# Altium project BugBuster.PrjPcb (part 2 of 4)

## Sheet Power.SchDoc
size A3; SheetNumber: 3; SheetTotal: 5
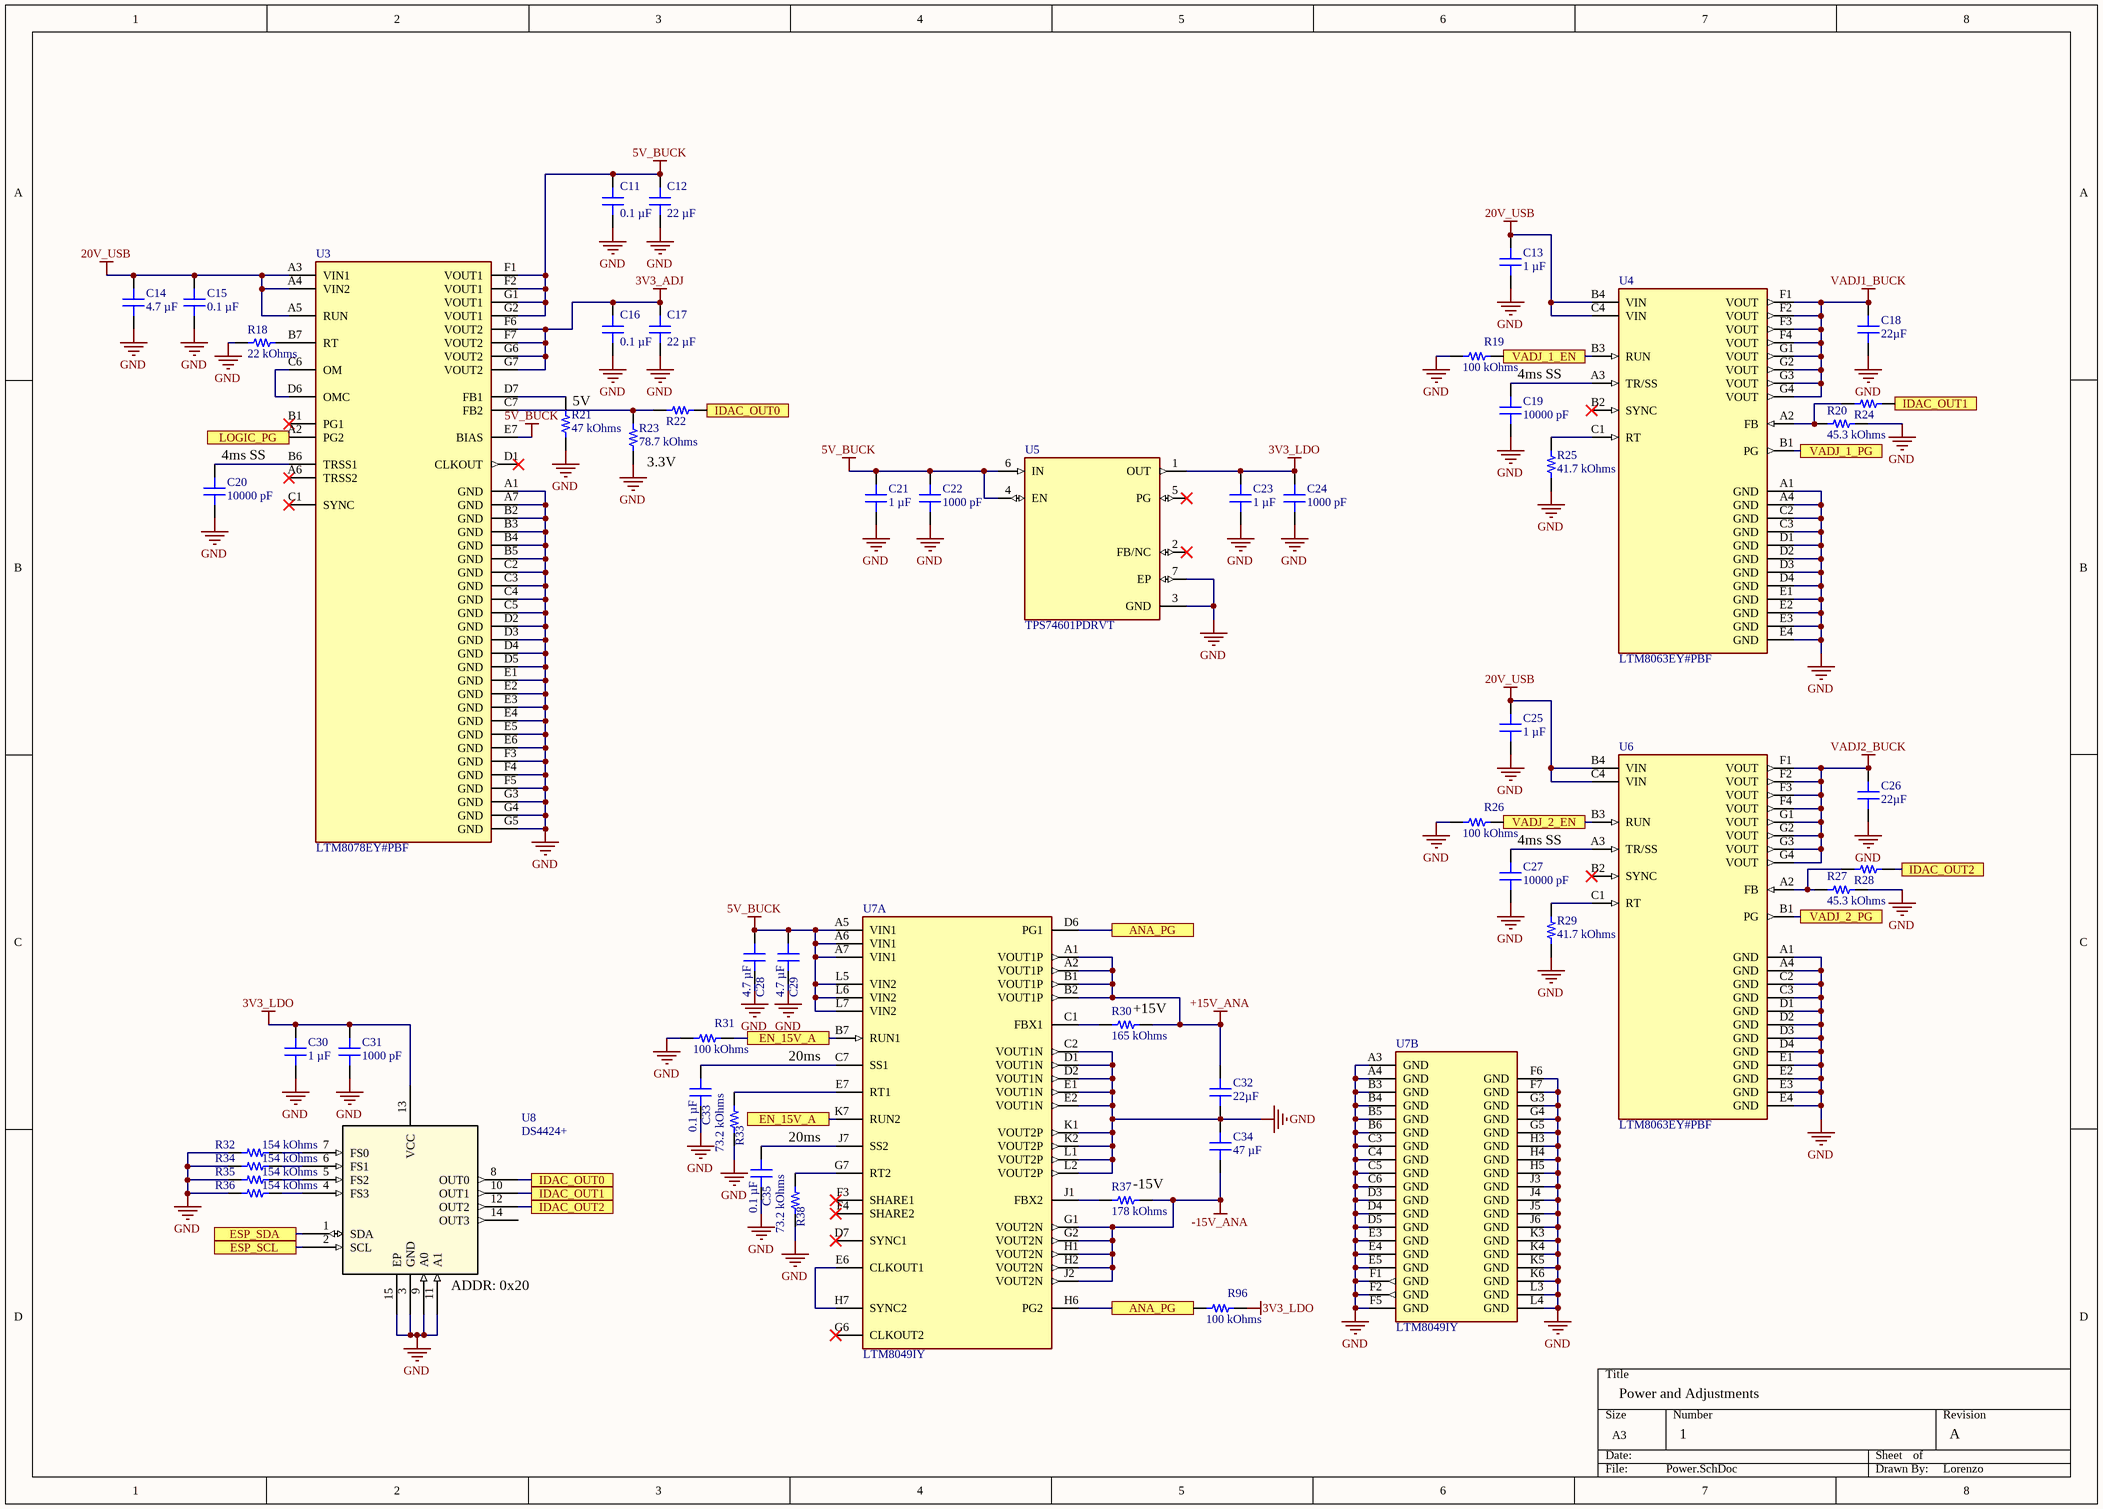
[diagram p2: Power.SchDoc]

### Parts
C11  0.1 µF  [CAP 0603_1608]
C12  22 µF  [CAP 0603_1608]
C13  1 µF  [CAP 0603_1608]
C14  4.7 µF  [CAP 0603_1608]
C15  0.1 µF  [CAP 0603_1608]
C16  0.1 µF  [CAP 0603_1608]
C17  22 µF  [CAP 0603_1608]
C18  22µF  [CAP 1210_3225 - 2.8MM]
C19  10000 pF  [CAP 0603_1608]
C20  10000 pF  [CAP 0603_1608]
C21  1 µF  [CAP 0603_1608]
C22  1000 pF  [CAP 0603_1608]
C23  1 µF  [CAP 0603_1608]
C24  1000 pF  [CAP 0603_1608]
C25  1 µF  [CAP 0603_1608]
C26  22µF  [CAP 1210_3225 - 2.8MM]
C27  10000 pF  [CAP 0603_1608]
C28  4.7 µF  [CAP 0603_1608]
C29  4.7 µF  [CAP 0603_1608]
C30  1 µF  [CAP 0603_1608]
C31  1000 pF  [CAP 0603_1608]
C32  22µF  [CAP 1210_3225 - 2.8MM]
C33  0.1 µF  [CAP 0603_1608]
C34  47 µF  [CAP 1210_3225 - 1MM]
C35  0.1 µF  [CAP 0603_1608]
R18  22 kOhms  [RES 0603_1608]
R19  100 kOhms  [RES 0603_1608]
R20  45.3 kOhms  [RES 0603_1608]
R21  47 kOhms  [RES 0603_1608]
R22  (no value)  [RES 0603_1608]
R23  78.7 kOhms  [RES 0603_1608]
R24  (no value)  [RES 0603_1608]
R25  41.7 kOhms  [RES 0603_1608]
R26  100 kOhms  [RES 0603_1608]
R27  45.3 kOhms  [RES 0603_1608]
R28  (no value)  [RES 0603_1608]
R29  41.7 kOhms  [RES 0603_1608]
R30  165 kOhms  [RES 0603_1608]
R31  100 kOhms  [RES 0603_1608]
R32  154 kOhms  [RES 0603_1608]
R33  73.2 kOhms  [RES 0603_1608]
R34  154 kOhms  [RES 0603_1608]
R35  154 kOhms  [RES 0603_1608]
R36  154 kOhms  [RES 0603_1608]
R37  178 kOhms  [RES 0603_1608]
R38  73.2 kOhms  [RES 0603_1608]
R96  100 kOhms  [RES 0603_1608]
U3  LTM8078EY#PBF  [FP-BGA-49-05-08-1518-IPC_C]
U4  LTM8063EY#PBF  [FP-BGA-28-05-08-1517-MFG]
U5  TPS74601PDRVT  [SON65P200X200X80-7N]
U6  LTM8063EY#PBF  [FP-BGA-28-05-08-1517-MFG]
U7  LTM8049IY  [FP-BGA-77-05-08-1964-MFG]  (parts A,B of 2)
U8  DS4424+  [21-0137_T1433+2_MXM]

### Ports
ANA_PG, EN_15V_A, ESP_SCL, ESP_SDA, IDAC_OUT0, IDAC_OUT1, IDAC_OUT2, LOGIC_PG, VADJ_1_EN, VADJ_1_PG, VADJ_2_EN, VADJ_2_PG

### Nets
3V3_ADJ: C16.2 C17.2 U3.F6(VOUT2) U3.F7(VOUT2) U3.G6(VOUT2) U3.G7(VOUT2)
3V3_LDO: C23.2 C24.2 C30.2 C31.2 R96.2 U5.1(OUT) U8.13(VCC)
5V_BUCK: C11.2 C12.2 C21.2 C22.2 C28.2 C29.2 U3.E7(BIAS) U3.F1(VOUT1) U3.F2(VOUT1) U3.G1(VOUT1) U3.G2(VOUT1) U5.4(EN) U5.6(IN) U7.A5(VIN1) U7.A6(VIN1) U7.A7(VIN1) U7.L5(VIN2) U7.L6(VIN2) U7.L7(VIN2)
20V_USB: C13.2 C14.2 C15.2 C25.2 U3.A3(VIN1) U3.A4(VIN2) U3.A5(RUN) U4.B4(VIN) U4.C4(VIN) U6.B4(VIN) U6.C4(VIN)
+15V_ANA: C32.2 R30.2 U7.A1(VOUT1P) U7.A2(VOUT1P) U7.B1(VOUT1P) U7.B2(VOUT1P)
-15V_ANA: C34.1 R37.2 U7.G1(VOUT2N) U7.G2(VOUT2N) U7.H1(VOUT2N) U7.H2(VOUT2N) U7.J2(VOUT2N)
GND: C11.1 C12.1 C13.1 C14.1 C15.1 C16.1 C17.1 C18.1 C19.1 C20.1 C21.1 C22.1 C23.1 C24.1 C25.1 C26.1 C27.1 C28.1 C29.1 C30.1 C31.1 C32.1 C33.1 C34.2 C35.1 R18.1 R19.1 R20.1 R21.1 R23.1 R25.1 R26.1 R27.1 R29.1 R31.1 R32.1 R33.1 R34.1 R35.1 R36.1 R38.1 U3.A1(GND) U3.A7(GND) U3.B2(GND) U3.B3(GND) U3.B4(GND) U3.B5(GND) U3.C2(GND) U3.C3(GND) U3.C4(GND) U3.C5(GND) U3.D2(GND) U3.D3(GND) U3.D4(GND) U3.D5(GND) U3.E1(GND) U3.E2(GND) U3.E3(GND) U3.E4(GND) U3.E5(GND) U3.E6(GND) U3.F3(GND) U3.F4(GND) U3.F5(GND) U3.G3(GND) U3.G4(GND) U3.G5(GND) U4.A1(GND) U4.A4(GND) U4.C2(GND) U4.C3(GND) U4.D1(GND) U4.D2(GND) U4.D3(GND) U4.D4(GND) U4.E1(GND) U4.E2(GND) U4.E3(GND) U4.E4(GND) U5.3(GND) U5.7(EP) U6.A1(GND) U6.A4(GND) U6.C2(GND) U6.C3(GND) U6.D1(GND) U6.D2(GND) U6.D3(GND) U6.D4(GND) U6.E1(GND) U6.E2(GND) U6.E3(GND) U6.E4(GND) U7.A3(GND) U7.A4(GND) U7.B3(GND) U7.B4(GND) U7.B5(GND) U7.B6(GND) U7.C2(VOUT1N) U7.C3(GND) U7.C4(GND) U7.C5(GND) U7.C6(GND) U7.D1(VOUT1N) U7.D2(VOUT1N) U7.D3(GND) U7.D4(GND) U7.D5(GND) U7.E1(VOUT1N) U7.E2(VOUT1N) U7.E3(GND) U7.E4(GND) U7.E5(GND) U7.F1(GND) U7.F2(GND) U7.F5(GND) U7.F6(GND) U7.F7(GND) U7.G3(GND) U7.G4(GND) U7.G5(GND) U7.H3(GND) U7.H4(GND) U7.H5(GND) U7.J3(GND) U7.J4(GND) U7.J5(GND) U7.J6(GND) U7.K1(VOUT2P) U7.K2(VOUT2P) U7.K3(GND) U7.K4(GND) U7.K5(GND) U7.K6(GND) U7.L1(VOUT2P) U7.L2(VOUT2P) U7.L3(GND) U7.L4(GND) U8.3(GND) U8.9(A0) U8.11(A1) U8.15(EP)
VADJ1_BUCK: C18.2 U4.F1(VOUT) U4.F2(VOUT) U4.F3(VOUT) U4.F4(VOUT) U4.G1(VOUT) U4.G2(VOUT) U4.G3(VOUT) U4.G4(VOUT)
VADJ2_BUCK: C26.2 U6.F1(VOUT) U6.F2(VOUT) U6.F3(VOUT) U6.F4(VOUT) U6.G1(VOUT) U6.G2(VOUT) U6.G3(VOUT) U6.G4(VOUT)
NetC19_2: C19.2 U4.A3(TR/SS)
NetC20_2: C20.2 U3.B6(TRSS1)
NetC27_2: C27.2 U6.A3(TR/SS)
NetC33_2: C33.2 U7.C7(SS1)
NetC35_2: C35.2 U7.J7(SS2)
NetR1_1: U8.1(SDA) ; port ESP_SDA
NetR2_1: U8.2(SCL) ; port ESP_SCL
NetR18_2: R18.2 U3.B7(RT)
NetR19_2: R19.2 U4.B3(RUN) ; port VADJ_1_EN
NetR20_2: R20.2 R24.1 U4.A2(FB)
NetR21_2: R21.2 U3.D7(FB1)
NetR22_1: R22.1 R23.2 U3.C7(FB2)
NetR22_2: R22.2 U8.8(OUT0) ; port IDAC_OUT0
NetR24_2: R24.2 U8.10(OUT1) ; port IDAC_OUT1
NetR25_2: R25.2 U4.C1(RT)
NetR26_2: R26.2 U6.B3(RUN) ; port VADJ_2_EN
NetR27_2: R27.2 R28.1 U6.A2(FB)
NetR28_2: R28.2 U8.12(OUT2) ; port IDAC_OUT2
NetR29_2: R29.2 U6.C1(RT)
NetR30_1: R30.1 U7.C1(FBX1)
NetR31_2: R31.2 U7.B7(RUN1) U7.K7(RUN2) ; port EN_15V_A
NetR32_2: R32.2 U8.7(FS0)
NetR33_2: R33.2 U7.E7(RT1)
NetR34_2: R34.2 U8.6(FS1)
NetR35_2: R35.2 U8.5(FS2)
NetR36_2: R36.2 U8.4(FS3)
NetR37_1: R37.1 U7.J1(FBX2)
NetR38_2: R38.2 U7.G7(RT2)
NetR96_1: R96.1 U7.D6(PG1) U7.H6(PG2) ; port ANA_PG
NetU3_A2: U3.A2(PG2) ; port LOGIC_PG
NetU3_C6: U3.C6(OM) U3.D6(OMC)
NetU4_B1: U4.B1(PG) ; port VADJ_1_PG
NetU6_B1: U6.B1(PG) ; port VADJ_2_PG
NetU7_E6: U7.E6(CLKOUT1) U7.H7(SYNC2)

Not connected (* = marked no-connect by the designer): U3 A6(TRSS2)* B1(PG1)* C1(SYNC)* D1(CLKOUT)*; U4 B2(SYNC)*; U5 2(FB/NC)* 5(PG)*; U6 B2(SYNC)*; U7 D7(SYNC1)* F3(SHARE1)* F4(SHARE2)* G6(CLKOUT2)*; U8 14(OUT3)

### Notes on the sheet
- (near C19) 4ms SS
- (near R21) 5V
- (near C20) 4ms SS
- (near R23) 3.3V
- (near C27) 4ms SS
- (near R30) +15V
- 20ms
- (near R37) -15V
- (near U8) ADDR: 0x20
- Power and Adjustments
- 1
- A
- Lorenzo

### Library data of the parts
C11 C15 C16 C33 C35 = CGA3E2X7R1H104M080AE: CAP CER 0.1UF 50V X7R 0603; manufacturer: TDK Corporation; Tolerance: ±20%; Part Number: CGA3E2X7R1H104M080AE; Value: 0.1 µF; Applications: Automotive, Boardflex Sensitive; Capacitance: 0.1 µF; componentlink1description: Datasheet; componentlink1url: https://product.tdk.com/info/en/catalog/datasheets/mlcc_automotive_soft_en.pdf?ref_disty=digikey; componentlink2description: DigiKey Link; componentlink2url: https://www.digikey.com/en/products/detail/tdk-corporation/CGA3E2X7R1H104M080AE/4490595; Device Package: 0603 (1608 Metric); Features: Soft Termination; lastupdated: 09/02/2024 20:10:15; Lifecycle Status: Active; Minimum Order: 1; Mounting Type: Surface Mount, MLCC; Operating Temperature: -55°C ~ 125°C; Package / Case: 0603 (1608 Metric); packaging: TapeAndReel; partid: 13634; Part Status: Active; price: 0.03; Ratings: AEC-Q200; series: CGA; Size / Dimension: 0.063" L x 0.031" W (1.60mm x 0.80mm); Supplier 1: DigiKey; Supplier Part Number 1: 445-15958-1-ND; Temperature Coefficient: X7R; Thickness (Max): 0.037" (0.95mm); Voltage - Rated: 50V
C12 C17 = CC0603MRX6S5BB226: CAP CER 22UF 6.3V X6S 0603; manufacturer: Yageo; Tolerance: ±20%; Part Number: CC0603MRX6S5BB226; Value: 22 µF; Applications: General Purpose; Capacitance: 22 µF; componentlink1description: Datasheet; componentlink1url: https://www.yageo.com/upload/media/product/productsearch/datasheet/mlcc/UPY-GPHC_X6S_4V-to-50V_5.pdf; componentlink2description: DigiKey Link; componentlink2url: https://www.digikey.com/en/products/detail/yageo/CC0603MRX6S5BB226/12698890; Device Package: 0603 (1608 Metric); lastupdated: 09/02/2024 20:09:49; Lifecycle Status: Active; Minimum Order: 1; Mounting Type: Surface Mount, MLCC; Operating Temperature: -55°C ~ 105°C; Package / Case: 0603 (1608 Metric); packaging: TapeAndReel; partid: 45941; Part Status: Active; price: 0.03; series: CC; Size / Dimension: 0.063" L x 0.031" W (1.60mm x 0.80mm); Supplier 1: DigiKey; Supplier Part Number 1: 13-CC0603MRX6S5BB226CT-ND; Temperature Coefficient: X6S; Thickness (Max): 0.039" (1.00mm); Voltage - Rated: 6.3V
C13 C21 C23 C25 C30 = C1608X5R1H105K080AB: CAP CER 1UF 50V X5R 0603; manufacturer: TDK Corporation; Tolerance: ±10%; Part Number: C1608X5R1H105K080AB; Value: 1 µF; Applications: General Purpose; Capacitance: 1 µF; componentlink1description: Datasheet; componentlink1url: https://product.tdk.com/info/en/catalog/datasheets/mlcc_commercial_general_en.pdf?ref_disty=digikey; componentlink2description: DigiKey Link; componentlink2url: https://www.digikey.com/en/products/detail/tdk-corporation/C1608X5R1H105K080AB/2732903; Device Package: 0603 (1608 Metric); Features: Low ESL; lastupdated: 09/02/2024 20:10:02; Lifecycle Status: Active; Minimum Order: 1; Mounting Type: Surface Mount, MLCC; Operating Temperature: -55°C ~ 85°C; Package / Case: 0603 (1608 Metric); packaging: TapeAndReel; partid: 36337; Part Status: Active; price: 0.02; series: C; Size / Dimension: 0.063" L x 0.031" W (1.60mm x 0.80mm); Supplier 1: DigiKey; Supplier Part Number 1: 445-7468-1-ND; Temperature Coefficient: X5R; Thickness (Max): 0.035" (0.90mm); Voltage - Rated: 50V
C14 C28 C29 = GRM188R61E475ME11J: CAP CER 4.7UF 25V X5R 0603; manufacturer: Murata Electronics; Tolerance: ±20%; Part Number: GRM188R61E475ME11J; Value: 4.7 µF; Applications: General Purpose; Capacitance: 4.7 µF; componentlink2description: DigiKey Link; componentlink2url: https://www.digikey.com/en/products/detail/murata-electronics/GRM188R61E475ME11J/10703204; Device Package: 0603 (1608 Metric); lastupdated: 09/02/2024 20:09:44; Lifecycle Status: Active; Minimum Order: 1; Mounting Type: Surface Mount, MLCC; Operating Temperature: -55°C ~ 85°C; Package / Case: 0603 (1608 Metric); packaging: TapeAndReel; partid: 47573; Part Status: Active; price: 0.03; series: GRM; Size / Dimension: 0.063" L x 0.032" W (1.60mm x 0.80mm); Supplier 1: DigiKey; Supplier Part Number 1: 490-GRM188R61E475ME11JCT-ND; Temperature Coefficient: X5R; Thickness (Max): 0.037" (0.95mm); Voltage - Rated: 25V
C18 C26 C32 = 12103C226KAT2A: CAP CER 22UF 25V X7R 1210; manufacturer: AVX Corporation; Tolerance: ±10%; Part Number: 12103C226KAT2A; Value: 22µF; Applications: General Purpose; Capacitance: 22µF; componentlink1description: Datasheet; componentlink1url: http://datasheets.avx.com/X7RDielectric.pdf; componentlink2description: DigiKey Link; componentlink2url: http://digikey.com/product-detail/en/avx-corporation/12103C226KAT2A/478-9964-1-ND/6149088; Device Package: 1210 (3225 Metric); lastupdated: 02/09/2020 01:10:48; Lifecycle Status: Active; Minimum Order: 1; Mounting Type: Surface Mount, MLCC; Operating Temperature: -55°C ~ 125°C; Package / Case: 1210 (3225 Metric); packaging: TapeAndReel; partid: 24236; Part Status: Active; price: 0.91; series: -; Size / Dimension: 0.130" L x 0.098" W (3.30mm x 2.50mm); Supplier 1: DigiKey; Supplier Part Number 1: 478-9964-1-ND; Temperature Coefficient: X7R; Thickness (Max): 0.110" (2.79mm); Voltage - Rated: 25V
C19 C20 C27 = C0603X103K5RAC7867: CAP CER 10000PF 50V X7R 0603; manufacturer: KEMET; Tolerance: ±10%; Part Number: C0603X103K5RAC7867; Value: 10000 pF; Applications: Boardflex Sensitive; Capacitance: 10000 pF; componentlink1description: Datasheet; componentlink1url: https://api.kemet.com/component-edge/download/datasheet/C0603X103K5RACTU.pdf; componentlink2description: DigiKey Link; componentlink2url: https://www.digikey.com/en/products/detail/kemet/C0603X103K5RAC7867/1842288; Device Package: 0603 (1608 Metric); Features: Soft Termination; lastupdated: 09/02/2024 20:09:59; Lifecycle Status: Active; Minimum Order: 1; Mounting Type: Surface Mount, MLCC; Operating Temperature: -55°C ~ 125°C; Package / Case: 0603 (1608 Metric); packaging: TapeAndReel; partid: 35676; Part Status: Active; price: 0.06; series: SMD Comm X7R Flex; Size / Dimension: 0.063" L x 0.031" W (1.60mm x 0.80mm); Supplier 1: DigiKey; Supplier Part Number 1: 399-C0603X103K5RAC7867CT-ND; Temperature Coefficient: X7R; Thickness (Max): 0.034" (0.87mm); Voltage - Rated: 50V
C22 C24 C31 = CC0603GRNPO8BN102: CAP CER 1000PF 25V C0G/NPO 0603; manufacturer: Yageo; Temperature Coefficient: C0G, NP0; Tolerance: ±2%; Part Number: CC0603GRNPO8BN102; Value: 1000 pF; Applications: General Purpose; Capacitance: 1000 pF; componentlink1description: Datasheet; componentlink1url: https://www.yageo.com/upload/media/product/productsearch/datasheet/mlcc/UPY-GP_NP0_16V-to-50V_17.pdf; componentlink2description: DigiKey Link; componentlink2url: https://www.digikey.com/en/products/detail/yageo/CC0603GRNPO8BN102/5883535; Device Package: 0603 (1608 Metric); lastupdated: 09/02/2024 20:10:07; Lifecycle Status: Active; Minimum Order: 1; Mounting Type: Surface Mount, MLCC; Operating Temperature: -55°C ~ 125°C; Package / Case: 0603 (1608 Metric); packaging: TapeAndReel; partid: 17388; Part Status: Active; price: 0.02; series: CC; Size / Dimension: 0.063" L x 0.031" W (1.60mm x 0.80mm); Supplier 1: DigiKey; Supplier Part Number 1: 311-3914-1-ND; Thickness (Max): 0.035" (0.90mm); Voltage - Rated: 25V
C34 = KGM32LR51E476MU: CAP CER 47UF 25V X5R 1210; manufacturer: KYOCERA AVX; Tolerance: ±20%; Part Number: KGM32LR51E476MU; Value: 47 µF; Applications: General Purpose; Capacitance: 47 µF; componentlink2description: DigiKey Link; componentlink2url: https://www.digikey.com/en/products/detail/kyocera-avx/KGM32LR51E476MU/11231511; Device Package: 1210 (3225 Metric); lastupdated: 04/06/2024 19:20:46; Lifecycle Status: Active; Minimum Order: 1; Mounting Type: Surface Mount, MLCC; Operating Temperature: -55°C ~ 85°C; Package / Case: 1210 (3225 Metric); packaging: TapeAndReel; partid: 51635; Part Status: Active; price: 1.07; series: KGM - X5R; Size / Dimension: 0.126" L x 0.098" W (3.20mm x 2.50mm); Supplier 1: DigiKey; Supplier Part Number 1: 478-KGM32LR51E476MUCT-ND; Temperature Coefficient: X5R; Thickness (Max): 0.110" (2.80mm); Voltage - Rated: 25V
R18 = KTR03EZPF2202: RES SMD 22K OHM 1% 1/10W 0603; Manufacturer: Rohm Semiconductor; Power (Watts): 0.1W, 1/10W; Temperature Coefficient: ±100ppm/°C; Part Number: KTR03EZPF2202; Value: 22 kOhms; ComponentLink1Description: Datasheet; ComponentLink1URL: https://www.rohm.com/datasheet/KTR03EZPF/ktr-e; ComponentLink2Description: DigiKey Link; ComponentLink2URL: https://www.digikey.com/en/products/detail/rohm-semiconductor/KTR03EZPF2202/4051603; Composition: Thick Film; Device Package: 0603 (1608 Metric); Features: Automotive AEC-Q200, High Voltage; Height - Seated (Max): 0.022" (0.55mm); LastUpdated: 09/02/2024 20:43:35; Lifecycle Status: Active; Minimum Order: 1; Number of Terminations: 2; Operating Temperature: -55°C ~ 155°C; Package / Case: 0603 (1608 Metric); Packaging: TapeAndReel; PartId: 5323; Part Status: Active; Price: 0.02; Ratings: AEC-Q200; Resistance: 22 kOhms; Series: KTR; Size / Dimension: 0.063" L x 0.031" W (1.60mm x 0.80mm); Supplier 1: DigiKey; Supplier Part Number 1: RHM22KAYCT-ND; Supplier Device Package: 0603; Tolerance: ±1%
R19 R26 R31 R96 = SG73P1JTTD1003F: RES 100K OHM 1% 1/3W 0603; Manufacturer: KOA Speer Electronics, Inc.; Power (Watts): 0.333W, 1/3W; Temperature Coefficient: ±100ppm/°C; Part Number: SG73P1JTTD1003F; Value: 100 kOhms; ComponentLink1Description: Datasheet; ComponentLink1URL: https://www.koaspeer.com/pdfs/SG73P.pdf; ComponentLink2Description: DigiKey Link; ComponentLink2URL: https://www.digikey.com/en/products/detail/koa-speer-electronics-inc/SG73P1JTTD1003F/10188341; Composition: Thick Film; Device Package: 0603 (1608 Metric); Features: Automotive AEC-Q200, Pulse Withstanding; Height - Seated (Max): 0.022" (0.55mm); LastUpdated: 09/02/2024 20:40:28; Lifecycle Status: Active; Minimum Order: 1; Number of Terminations: 2; Operating Temperature: -55°C ~ 155°C; Package / Case: 0603 (1608 Metric); Packaging: TapeAndReel; PartId: 83707; Price: 0.01; Ratings: AEC-Q200; Resistance: 100 kOhms; Series: SG73P; Size / Dimension: 0.063" L x 0.031" W (1.60mm x 0.80mm); Supplier 1: DigiKey; Supplier Part Number 1: 2019-SG73P1JTTD1003FCT-ND; Supplier Device Package: 0603; Tolerance: ±1%
R20 R27 = AC0603FR-0745K3L: RES SMD 45.3K OHM 1% 1/10W 0603; Manufacturer: Yageo; Power (Watts): 0.1W, 1/10W; Temperature Coefficient: ±100ppm/°C; Part Number: AC0603FR-0745K3L; Value: 45.3 kOhms; ComponentLink1Description: Datasheet; ComponentLink1URL: https://www.yageo.com/upload/media/product/productsearch/datasheet/rchip/PYu-AC_51_RoHS_L_8.pdf; ComponentLink2Description: DigiKey Link; ComponentLink2URL: https://www.digikey.com/en/products/detail/yageo/AC0603FR-0745K3L/5896132; Composition: Thick Film; Device Package: 0603 (1608 Metric); Features: Automotive AEC-Q200, Moisture Resistant; Height - Seated (Max): 0.022" (0.55mm); LastUpdated: 09/02/2024 20:41:10; Lifecycle Status: Active; Minimum Order: 1; Number of Terminations: 2; Operating Temperature: -55°C ~ 155°C; Package / Case: 0603 (1608 Metric); Packaging: CutTape; PartId: 67933; Part Status: Active; Price: 0.01; Ratings: AEC-Q200; Resistance: 45.3 kOhms; Series: AC; Size / Dimension: 0.063" L x 0.031" W (1.60mm x 0.80mm); Supplier 1: DigiKey; Supplier Part Number 1: 13-AC0603FR-0745K3LCT-ND; Supplier Device Package: 0603; Tolerance: ±1%
R21 = RCA060347K0FKEA: RES SMD 47K OHM 1% 1/10W 0603; Manufacturer: Vishay Dale; Power (Watts): 0.1W, 1/10W; Temperature Coefficient: ±100ppm/°C; Part Number: RCA060347K0FKEA; Value: 47 kOhms; ComponentLink1Description: Datasheet; ComponentLink1URL: http://www.vishay.com/docs/20037/rcae3.pdf; ComponentLink2Description: DigiKey Link; ComponentLink2URL: https://www.digikey.com/en/products/detail/vishay-dale/RCA060347K0FKEA/4946776; Composition: Thick Film; Device Package: 0603 (1608 Metric); Features: Anti-Sulfur, Automotive AEC-Q200; Height - Seated (Max): 0.020" (0.50mm); LastUpdated: 09/02/2024 20:43:04; Lifecycle Status: Active; Minimum Order: 1; Number of Terminations: 2; Operating Temperature: -55°C ~ 155°C; Package / Case: 0603 (1608 Metric); Packaging: TapeAndReel; PartId: 12976; Part Status: Active; Price: 0.01; Ratings: AEC-Q200; Resistance: 47 kOhms; Series: RCA; Size / Dimension: 0.061" L x 0.033" W (1.55mm x 0.85mm); Supplier 1: DigiKey; Supplier Part Number 1: 541-2207-1-ND; Supplier Device Package: 0603; Tolerance: ±1%
R22 R24 R28 = MCT0603MZ0000ZP500: RES 0 OHM JUMPER 1/8W 0603; Manufacturer: Vishay Beyschlag; Power (Watts): 0.125W, 1/8W; Part Number: MCT0603MZ0000ZP500; ComponentLink1Description: Datasheet; ComponentLink1URL: http://www.vishay.com/docs/28760/mcat_pro.pdf; ComponentLink2Description: DigiKey Link; ComponentLink2URL: http://digikey.com/product-detail/en/vishay-beyschlag/MCT0603MZ0000ZP500/749-1745-1-ND/7348053; Composition: Thin Film; Device Package: 0603 (1608 Metric); Features: Anti-Sulfur, Automotive AEC-Q200; Height - Seated (Max): 0.022" (0.55mm); LastUpdated: 14/02/2022 15:05:22; Lifecycle Status: Active; Minimum Order: 1; Number of Terminations: 2; Operating Temperature: -55°C ~ 155°C; Package / Case: 0603 (1608 Metric); Packaging: TapeAndReel; PartId: 10258; Part Status: Active; Price: 0.04; Ratings: AEC-Q200; Series: MCT AT - Professional; Size / Dimension: 0.061" L x 0.033" W (1.55mm x 0.85mm); Supplier 1: DigiKey; Supplier Part Number 1: 749-1745-1-ND; Supplier Device Package: 0603; Tolerance: Jumper
R23 = CPF0603F78K7C1: RES SMD 78.7K OHM 1% 1/16W 0603; Manufacturer: TE Connectivity Passive Product; Power (Watts): 0.063W, 1/16W; Temperature Coefficient: ±50ppm/°C; Part Number: CPF0603F78K7C1; Value: 78.7 kOhms; ComponentLink1Description: Datasheet; ComponentLink1URL: https://www.te.com/commerce/DocumentDelivery/DDEController?Action=srchrtrv&DocNm=1773200&DocType=DS&DocLang=English; ComponentLink2Description: DigiKey Link; ComponentLink2URL: https://www.digikey.com/en/products/detail/te-connectivity-passive-product/CPF0603F78K7C1/2384668; Composition: Thin Film; Device Package: 0603 (1608 Metric); Height - Seated (Max): 0.022" (0.55mm); LastUpdated: 09/02/2024 20:43:28; Lifecycle Status: Active; Minimum Order: 1; Number of Terminations: 2; Operating Temperature: -55°C ~ 155°C; Package / Case: 0603 (1608 Metric); Packaging: TapeAndReel; PartId: 7055; Part Status: Active; Price: 0.02; Resistance: 78.7 kOhms; Series: CPF, Neohm; Size / Dimension: 0.061" L x 0.031" W (1.55mm x 0.80mm); Supplier 1: DigiKey; Supplier Part Number 1: A102318CT-ND; Supplier Device Package: 0603; Tolerance: ±1%
R25 R29 = RN73R1JTTD4172F10: RES 41.7K OHM 1% 1/10W 0603; Manufacturer: KOA Speer Electronics, Inc.; Power (Watts): 0.1W, 1/10W; Temperature Coefficient: ±10ppm/°C; Part Number: RN73R1JTTD4172F10; Value: 41.7 kOhms; ComponentLink1Description: Datasheet; ComponentLink1URL: https://media.digikey.com/pdf/Data%20Sheets/KOA%20Speer/RN73R_Type_DS.pdf; ComponentLink2Description: DigiKey Link; ComponentLink2URL: https://www.digikey.com/en/products/detail/koa-speer-electronics-inc/RN73R1JTTD4172F10/10017113; Composition: Thin Film; Device Package: 0603 (1608 Metric); Features: Automotive AEC-Q200, Moisture Resistant; Height - Seated (Max): 0.022" (0.55mm); LastUpdated: 09/02/2024 20:41:25; Lifecycle Status: Active; Minimum Order: 1; Number of Terminations: 2; Operating Temperature: -55°C ~ 155°C; Package / Case: 0603 (1608 Metric); Packaging: TapeAndReel; PartId: 62816; Part Status: Active; Price: 0.08; Ratings: AEC-Q200; Resistance: 41.7 kOhms; Series: RN73R; Size / Dimension: 0.063" L x 0.031" W (1.60mm x 0.80mm); Supplier 1: DigiKey; Supplier Part Number 1: 2019-RN73R1JTTD4172F10CT-ND; Supplier Device Package: 0603; Tolerance: ±1%
R30 = RC0603FR-07165KL: RES 165K OHM 1% 1/10W 0603; Manufacturer: Yageo; Power (Watts): 0.1W, 1/10W; Temperature Coefficient: ±100ppm/°C; Part Number: RC0603FR-07165KL; Value: 165 kOhms; ComponentLink1Description: Datasheet; ComponentLink1URL: https://www.yageo.com/upload/media/product/productsearch/datasheet/rchip/PYu-RC_Group_51_RoHS_L_10.pdf; ComponentLink2Description: DigiKey Link; ComponentLink2URL: https://www.digikey.com/en/products/detail/yageo/RC0603FR-07165KL/726977; Composition: Thick Film; Device Package: 0603 (1608 Metric); Features: Moisture Resistant; Height - Seated (Max): 0.022" (0.55mm); LastUpdated: 09/02/2024 20:43:06; Lifecycle Status: Active; Minimum Order: 1; Number of Terminations: 2; Operating Temperature: -55°C ~ 155°C; Package / Case: 0603 (1608 Metric); Packaging: CutTape; PartId: 12456; Part Status: Active; Price: 0.01; Resistance: 165 kOhms; Series: RC_L; Size / Dimension: 0.063" L x 0.031" W (1.60mm x 0.80mm); Supplier 1: DigiKey; Supplier Part Number 1: 311-165KHRCT-ND; Supplier Device Package: 0603; Tolerance: ±1%
R32 R34-R36 = AC0603FR-07154KL: RES SMD 154K OHM 1% 1/10W 0603; Manufacturer: Yageo; Power (Watts): 0.1W, 1/10W; Temperature Coefficient: ±100ppm/°C; Part Number: AC0603FR-07154KL; Value: 154 kOhms; ComponentLink1Description: Datasheet; ComponentLink1URL: https://media.digikey.com/pdf/Data%20Sheets/Yageo%20PDFs/AC%20Series,%20Automotive.pdf; ComponentLink2Description: DigiKey Link; ComponentLink2URL: https://www.digikey.com/en/products/detail/yageo/AC0603FR-07154KL/5895797; Composition: Thick Film; Device Package: 0603 (1608 Metric); Features: Automotive AEC-Q200, Moisture Resistant; Height - Seated (Max): 0.022" (0.55mm); LastUpdated: 09/02/2024 20:40:39; Lifecycle Status: Active; Minimum Order: 1; Number of Terminations: 2; Operating Temperature: -55°C ~ 155°C; Package / Case: 0603 (1608 Metric); Packaging: CutTape; PartId: 79462; Price: 0.01; Ratings: AEC-Q200; Resistance: 154 kOhms; Series: AC; Size / Dimension: 0.063" L x 0.031" W (1.60mm x 0.80mm); Supplier 1: DigiKey; Supplier Part Number 1: 13-AC0603FR-07154KLCT-ND; Supplier Device Package: 0603; Tolerance: ±1%
R33 R38 = RC0603FR-0773K2L: RES 73.2K OHM 1% 1/10W 0603; Manufacturer: Yageo; Power (Watts): 0.1W, 1/10W; Temperature Coefficient: ±100ppm/°C; Part Number: RC0603FR-0773K2L; Value: 73.2 kOhms; ComponentLink1Description: Datasheet; ComponentLink1URL: https://www.yageo.com/upload/media/product/productsearch/datasheet/rchip/PYu-RC_Group_51_RoHS_L_10.pdf; ComponentLink2Description: DigiKey Link; ComponentLink2URL: https://www.digikey.com/en/products/detail/yageo/RC0603FR-0773K2L/727374; Composition: Thick Film; Device Package: 0603 (1608 Metric); Features: Moisture Resistant; Height - Seated (Max): 0.022" (0.55mm); LastUpdated: 09/02/2024 20:43:06; Lifecycle Status: Active; Minimum Order: 1; Number of Terminations: 2; Operating Temperature: -55°C ~ 155°C; Package / Case: 0603 (1608 Metric); Packaging: CutTape; PartId: 12298; Part Status: Active; Price: 0.01; Resistance: 73.2 kOhms; Series: RC_L; Size / Dimension: 0.063" L x 0.031" W (1.60mm x 0.80mm); Supplier 1: DigiKey; Supplier Part Number 1: 311-73.2KHRCT-ND; Supplier Device Package: 0603; Tolerance: ±1%
R37 = RK73H1JTTD1783F: RES 178K OHM 1% 1/10W 0603; Manufacturer: KOA Speer Electronics, Inc.; Power (Watts): 0.1W, 1/10W; Temperature Coefficient: ±100ppm/°C; Part Number: RK73H1JTTD1783F; Value: 178 kOhms; ComponentLink1Description: Datasheet; ComponentLink1URL: http://www.koaspeer.com/catimages/Products/RK73H/RK73H.pdf; ComponentLink2Description: DigiKey Link; ComponentLink2URL: https://www.digikey.com/en/products/detail/koa-speer-electronics-inc/RK73H1JTTD1783F/9845129; Composition: Thick Film; Device Package: 0603 (1608 Metric); Features: Automotive AEC-Q200, Moisture Resistant; Height - Seated (Max): 0.022" (0.55mm); LastUpdated: 09/02/2024 20:43:21; Lifecycle Status: Active; Minimum Order: 1; Number of Terminations: 2; Operating Temperature: -55°C ~ 155°C; Package / Case: 0603 (1608 Metric); Packaging: CutTape; PartId: 8649; Part Status: Active; Price: 0.01; Ratings: AEC-Q200; Resistance: 178 kOhms; Series: RK73H; Size / Dimension: 0.063" L x 0.031" W (1.60mm x 0.80mm); Supplier 1: DigiKey; Supplier Part Number 1: 2019-RK73H1JTTD1783FCT-ND; Supplier Device Package: 0603; Tolerance: ±1%
U3 = CMP-09139-000054-1: DUAL 40VIN, 3A SILENT SWITCR UMO
U4 U6 = CMP-09139-000005-1: DC DC CONVERTER 0.8-15V; Manufacturer: Analog Devices; Standoff Height: 0.3mm; Output Current: 2uA; Switching Frequency: 200-2200kHz; Max Supply Voltage: 40V; Min Supply Voltage: 3.2V; Output Type: AdjustableProgrammable; Max Junction Temp: +125°C; Number Of Outputs: 1; Nominal Supply Current: 3-8uA; Switching Topology: Buck; ComponentLink2URL: https://www.analog.com/media/en/technical-documentation/data-sheets/LTM8063.pdf; Height: 2.42mm; Temperature Range Low: -40°C; Mouser Description: Module DC-DC 1-OUT 0.8V to 15V 2A Automotive 28-Pin BGA Tray; Temperature Range High: +125°C; Octopart: https://octopart.com/ltm8063ey%23pbf-analog+devices-88947122; Category: IC; Device Class L3: Voltage Regulators - Switching; Output Voltage: 0.8-15V; Manufacturer Part Number: LTM8063EY#PBF; Package: BGA-28-05-08-1517; Automotive: No; RoHS: TRUE; Device Class L1: Integrated Circuits (ICs); Digikey Description: DC DC CONVERTER 0.8-15V; Ipc Land Pattern Name: BGA28C80P4X7_625X400X242; Lead Free: Yes; Temperature: -40°C to +125°C; Device Class L2: Power Management ICs; ComponentLink2Description: Datasheet
U5 = TPS74601PDRVT: 1-A, low-IQ, high-accuracy, adjustable ultra-low-dropout voltage regulator with power good & enable; MF: Texas Instruments; SnapEDA_Link: https://www.snapeda.com/parts/TPS74601PDRVT/Texas+Instruments/view-part/?ref=snap; Package: WSON-6 Texas Instruments; Value: *; MP: TPS74601PDRVT; Check_prices: https://www.snapeda.com/parts/TPS74601PDRVT/Texas+Instruments/view-part/?ref=eda
U7 = CMP-09139-000109-1: DC DC CONVERTER +/-2.5 TO +/-24V; RoHS Compliant: No
U8 = DS4424: Two-/Four-Channel, IÂ²C, 7-Bit Sink/Source Current DAC; Manufacturer_Name: Analog Devices Inc; Manufacturer_Part_Number: ds4424n+; Copyright: Copyright (C) 2026 Ultra Librarian. All rights reserved.; RefDes: RefDes; Type: Type